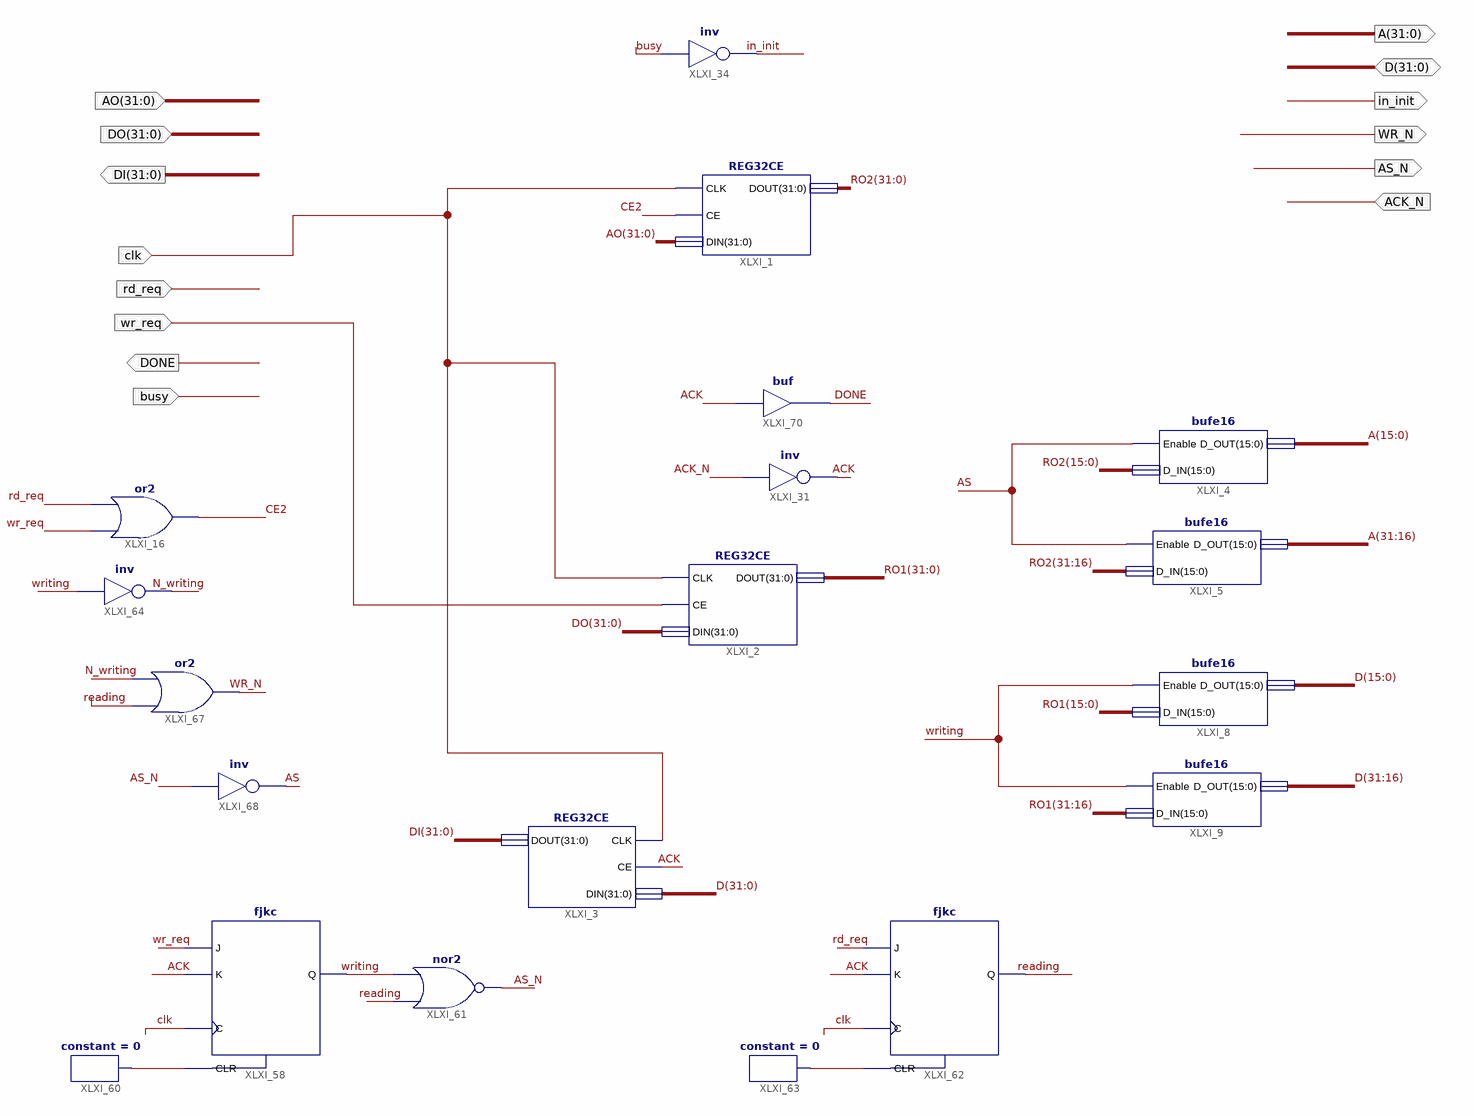
[diagram p0: schematic sheet 1]
// Xilinx ISE schematic bus_inf.sch (spartan3) as structural Verilog: 19 symbols, 14 ports
module bus_inf (
  input  [31:0] AO,
  input  [31:0] DO,
  input  clk,
  input  rd_req,
  input  wr_req,
  input  busy,
  input  ACK_N,
  inout  [31:0] D,
  output [31:0] DI,
  output DONE,
  output [31:0] A,
  output WR_N,
  output in_init,
  output AS_N
);

  wire ACK, AS, CE2, N_writing, reading, writing, XLXN_136, XLXN_143;
  wire [31:0] RO1, RO2;

  REG32CE XLXI_1 (.CLK(clk), .CE(CE2), .DIN(AO), .DOUT(RO2));
  REG32CE XLXI_2 (.CLK(clk), .CE(wr_req), .DIN(DO), .DOUT(RO1));
  REG32CE XLXI_3 (.CLK(clk), .CE(ACK), .DIN(D), .DOUT(DI));
  bufe16 XLXI_9 (.Enable(writing), .D_IN(RO1[31:16]), .D_OUT(D[31:16]));
  bufe16 XLXI_8 (.Enable(writing), .D_IN(RO1[15:0]), .D_OUT(D[15:0]));
  bufe16 XLXI_5 (.Enable(AS), .D_IN(RO2[31:16]), .D_OUT(A[31:16]));
  not XLXI_31 (ACK, ACK_N);
  bufe16 XLXI_4 (.Enable(AS), .D_IN(RO2[15:0]), .D_OUT(A[15:0]));
  fjkc XLXI_58 (.C(clk), .CLR(XLXN_136), .J(wr_req), .K(ACK), .Q(writing));
  constant #(.CValue("0")) XLXI_60 (.O(XLXN_136));
  nor XLXI_61 (AS_N, reading, writing);
  fjkc XLXI_62 (.C(clk), .CLR(XLXN_143), .J(rd_req), .K(ACK), .Q(reading));
  constant #(.CValue("0")) XLXI_63 (.O(XLXN_143));
  or XLXI_16 (CE2, wr_req, rd_req);
  not XLXI_64 (N_writing, writing);
  or XLXI_67 (WR_N, reading, N_writing);
  not XLXI_68 (AS, AS_N);
  buf XLXI_70 (DONE, ACK);
  not XLXI_34 (in_init, busy);
endmodule
